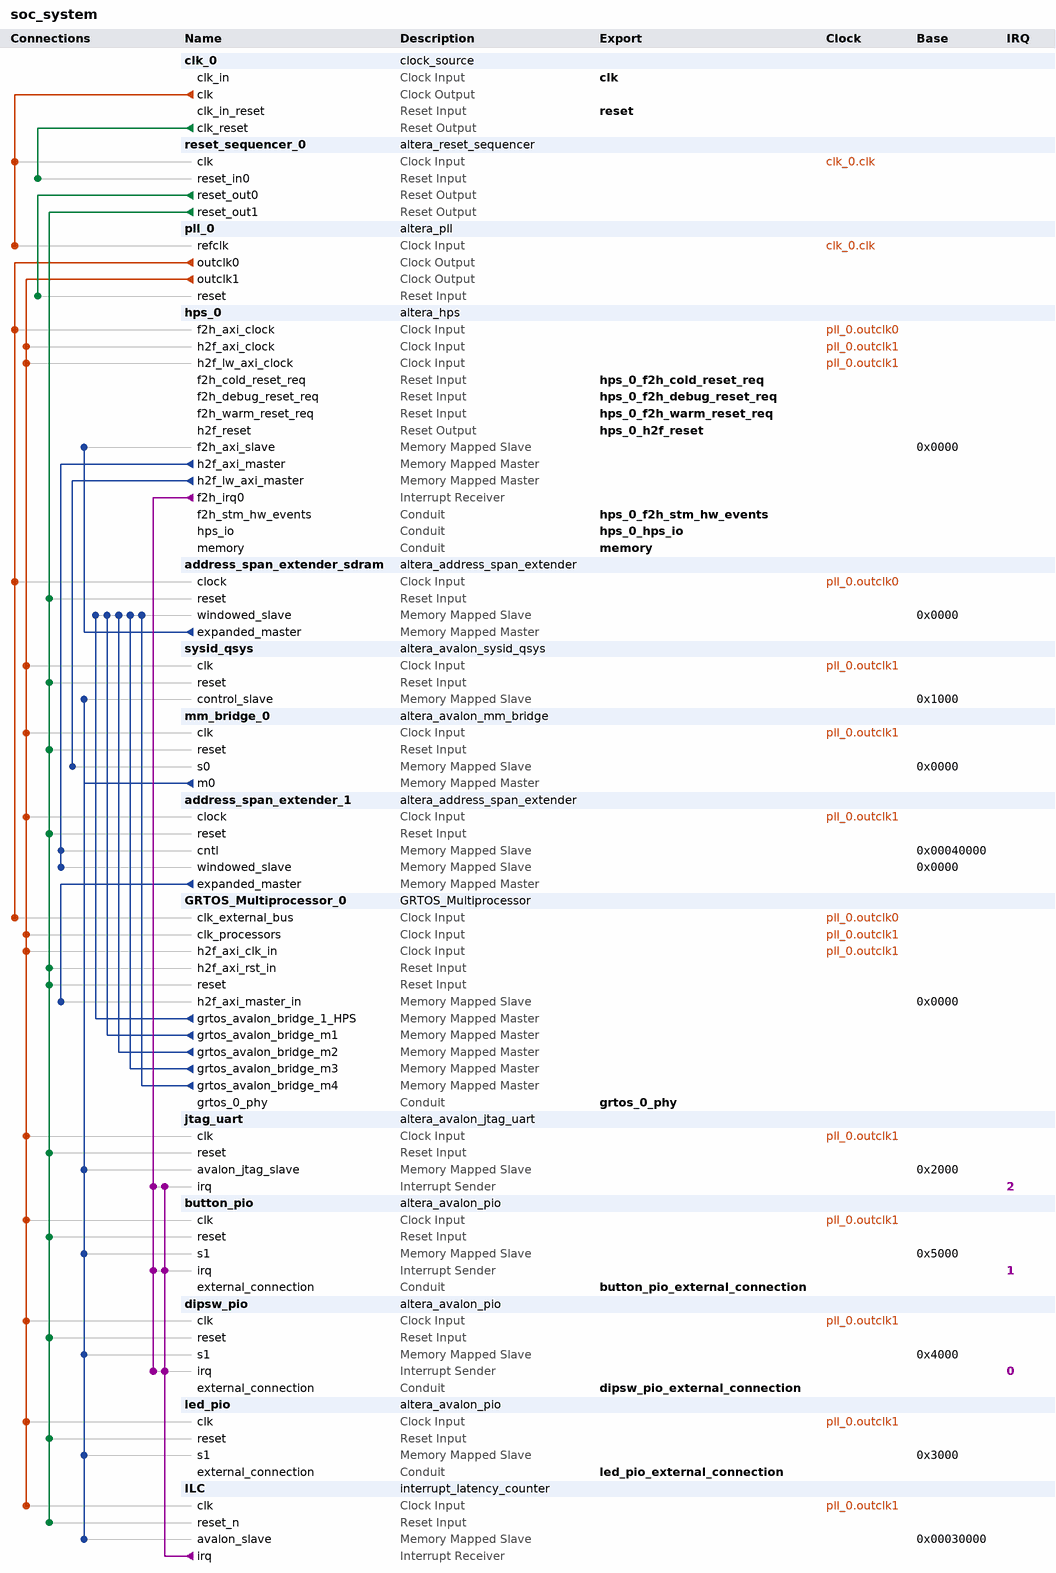
[diagram p0: system contents]
# Platform Designer (Qsys) system soc_system, Cyclone V 5CSEBA6U23I7
# Parameters at their usual value, and those the tool derives, are not listed.
package require -exact qsys 18.0
create_system soc_system
set_project_property DEVICE_FAMILY {Cyclone V}
set_project_property DEVICE 5CSEBA6U23I7

add_instance clk_0 clock_source 18.0
set_instance_parameter_value clk_0 clockFrequency 50000000
set_instance_parameter_value clk_0 resetSynchronousEdges DEASSERT

add_instance reset_sequencer_0 altera_reset_sequencer 18.0
set_instance_parameter_value reset_sequencer_0 ENABLE_CSR 0
set_instance_parameter_value reset_sequencer_0 ENABLE_RESET_REQUEST_INPUT 0
set_instance_parameter_value reset_sequencer_0 LIST_ASRT_DELAY 0,200,0,0,0,0,0,0,0,0
set_instance_parameter_value reset_sequencer_0 LIST_ASRT_SEQ 0,1,2,3,4,5,6,7,8,9
set_instance_parameter_value reset_sequencer_0 LIST_DSRT_DELAY 300,300,0,0,0,0,0,0,0,0
set_instance_parameter_value reset_sequencer_0 LIST_DSRT_SEQ 0,1,2,3,4,5,6,7,8,9
set_instance_parameter_value reset_sequencer_0 MIN_ASRT_TIME 100
set_instance_parameter_value reset_sequencer_0 NUM_INPUTS 1
set_instance_parameter_value reset_sequencer_0 NUM_OUTPUTS 2
set_instance_parameter_value reset_sequencer_0 USE_DSRT_QUAL 0,0,0,0,0,0,0,0,0,0

add_instance pll_0 altera_pll 18.0
set_instance_parameter_value pll_0 gui_device_speed_grade 1
set_instance_parameter_value pll_0 gui_number_of_clocks 2
set_instance_parameter_value pll_0 gui_operation_mode direct
set_instance_parameter_value pll_0 gui_output_clock_frequency0 120.0
set_instance_parameter_value pll_0 gui_output_clock_frequency1 20.0
set_instance_parameter_value pll_0 gui_pll_mode {Integer-N PLL}
set_instance_parameter_value pll_0 gui_reference_clock_frequency 50.0
set_instance_parameter_value pll_0 gui_switchover_mode {Manual Switchover}
set_instance_parameter_value pll_0 gui_use_locked false

add_instance hps_0 altera_hps 18.0
set_instance_parameter_value hps_0 EMAC1_Mode RGMII
set_instance_parameter_value hps_0 EMAC1_PinMuxing {HPS I/O Set 0}
set_instance_parameter_value hps_0 F2SCLK_COLDRST_Enable true
set_instance_parameter_value hps_0 F2SCLK_DBGRST_Enable true
set_instance_parameter_value hps_0 F2SCLK_WARMRST_Enable true
set_instance_parameter_value hps_0 F2SINTERRUPT_Enable true
set_instance_parameter_value hps_0 F2S_Width 1
set_instance_parameter_value hps_0 FPGA_PERIPHERAL_OUTPUT_CLOCK_FREQ_EMAC0_GTX_CLK 100
set_instance_parameter_value hps_0 FPGA_PERIPHERAL_OUTPUT_CLOCK_FREQ_EMAC0_MD_CLK 100.0
set_instance_parameter_value hps_0 FPGA_PERIPHERAL_OUTPUT_CLOCK_FREQ_EMAC1_GTX_CLK 100
set_instance_parameter_value hps_0 FPGA_PERIPHERAL_OUTPUT_CLOCK_FREQ_EMAC1_MD_CLK 100.0
set_instance_parameter_value hps_0 HPS_PROTOCOL DDR3
set_instance_parameter_value hps_0 I2C0_Mode I2C
set_instance_parameter_value hps_0 I2C0_PinMuxing {HPS I/O Set 0}
set_instance_parameter_value hps_0 I2C1_Mode I2C
set_instance_parameter_value hps_0 I2C1_PinMuxing {HPS I/O Set 0}
set_instance_parameter_value hps_0 LWH2F_Enable true
set_instance_parameter_value hps_0 MEM_BANKADDR_WIDTH 3
set_instance_parameter_value hps_0 MEM_CLK_FREQ 400.0
set_instance_parameter_value hps_0 MEM_COL_ADDR_WIDTH 10
set_instance_parameter_value hps_0 MEM_DQ_WIDTH 32
set_instance_parameter_value hps_0 MEM_DRV_STR RZQ/6
set_instance_parameter_value hps_0 MEM_ROW_ADDR_WIDTH 15
set_instance_parameter_value hps_0 MEM_RTT_NOM RZQ/6
set_instance_parameter_value hps_0 MEM_RTT_WR {Dynamic ODT off}
set_instance_parameter_value hps_0 MEM_TCL 7
set_instance_parameter_value hps_0 MEM_TFAW_NS 37.5
set_instance_parameter_value hps_0 MEM_TRAS_NS 35.0
set_instance_parameter_value hps_0 MEM_TRCD_NS 13.75
set_instance_parameter_value hps_0 MEM_TRFC_NS 300.0
set_instance_parameter_value hps_0 MEM_TRP_NS 13.75
set_instance_parameter_value hps_0 MEM_VENDOR Other
set_instance_parameter_value hps_0 MEM_WTCL 7
set_instance_parameter_value hps_0 QSPI_Mode N/A
set_instance_parameter_value hps_0 QSPI_PinMuxing Unused
set_instance_parameter_value hps_0 REF_CLK_FREQ 25.0
set_instance_parameter_value hps_0 S2FCLK_USER2CLK 4
set_instance_parameter_value hps_0 S2F_Width 1
set_instance_parameter_value hps_0 SDIO_Mode {4-bit Data}
set_instance_parameter_value hps_0 SDIO_PinMuxing {HPS I/O Set 0}
set_instance_parameter_value hps_0 SPIM1_Mode {Single Slave Select}
set_instance_parameter_value hps_0 SPIM1_PinMuxing {HPS I/O Set 0}
set_instance_parameter_value hps_0 STM_Enable true
set_instance_parameter_value hps_0 TIMING_BOARD_AC_SKEW 0.02
set_instance_parameter_value hps_0 TIMING_BOARD_AC_TO_CK_SKEW 0.0
set_instance_parameter_value hps_0 TIMING_BOARD_DQ_TO_DQS_SKEW 0.0
set_instance_parameter_value hps_0 TIMING_BOARD_MAX_CK_DELAY 0.6
set_instance_parameter_value hps_0 TIMING_BOARD_MAX_DQS_DELAY 0.6
set_instance_parameter_value hps_0 TIMING_BOARD_SKEW_BETWEEN_DQS 0.02
set_instance_parameter_value hps_0 TIMING_BOARD_SKEW_CKDQS_DIMM_MAX 0.01
set_instance_parameter_value hps_0 TIMING_BOARD_SKEW_CKDQS_DIMM_MIN -0.01
set_instance_parameter_value hps_0 TIMING_BOARD_SKEW_WITHIN_DQS 0.02
set_instance_parameter_value hps_0 TIMING_TDH 125
set_instance_parameter_value hps_0 TIMING_TDQSCK 400
set_instance_parameter_value hps_0 TIMING_TDQSQ 120
set_instance_parameter_value hps_0 TIMING_TDS 50
set_instance_parameter_value hps_0 TIMING_TIH 250
set_instance_parameter_value hps_0 TIMING_TIS 175
set_instance_parameter_value hps_0 TIMING_TQSH 0.38
set_instance_parameter_value hps_0 UART0_Mode {No Flow Control}
set_instance_parameter_value hps_0 UART0_PinMuxing {HPS I/O Set 0}
set_instance_parameter_value hps_0 USB1_Mode SDR
set_instance_parameter_value hps_0 USB1_PinMuxing {HPS I/O Set 0}
set_instance_parameter_value hps_0 desired_cfg_clk_mhz 100.0
set_instance_parameter_value hps_0 desired_qspi_clk_mhz 370.0

add_instance address_span_extender_sdram altera_address_span_extender 18.0
set_instance_parameter_value address_span_extender_sdram BURSTCOUNT_WIDTH 1
set_instance_parameter_value address_span_extender_sdram DATA_WIDTH 32
set_instance_parameter_value address_span_extender_sdram ENABLE_SLAVE_PORT false
set_instance_parameter_value address_span_extender_sdram MASTER_ADDRESS_DEF 536870912
set_instance_parameter_value address_span_extender_sdram MAX_PENDING_READS 32
set_instance_parameter_value address_span_extender_sdram SLAVE_ADDRESS_WIDTH 24

add_instance sysid_qsys altera_avalon_sysid_qsys 18.0
set_instance_parameter_value sysid_qsys id -1395322110

add_instance mm_bridge_0 altera_avalon_mm_bridge 18.0
set_instance_parameter_value mm_bridge_0 ADDRESS_UNITS SYMBOLS
set_instance_parameter_value mm_bridge_0 ADDRESS_WIDTH 10
set_instance_parameter_value mm_bridge_0 DATA_WIDTH 32
set_instance_parameter_value mm_bridge_0 MAX_PENDING_RESPONSES 4
set_instance_parameter_value mm_bridge_0 USE_AUTO_ADDRESS_WIDTH 1

add_instance address_span_extender_1 altera_address_span_extender 18.0
set_instance_parameter_value address_span_extender_1 BURSTCOUNT_WIDTH 1
set_instance_parameter_value address_span_extender_1 DATA_WIDTH 32
set_instance_parameter_value address_span_extender_1 ENABLE_SLAVE_PORT true
set_instance_parameter_value address_span_extender_1 MASTER_ADDRESS_DEF 0
set_instance_parameter_value address_span_extender_1 MAX_PENDING_READS 64
set_instance_parameter_value address_span_extender_1 SLAVE_ADDRESS_WIDTH 16

add_instance GRTOS_Multiprocessor_0 GRTOS_Multiprocessor 1.0
set_instance_parameter_value GRTOS_Multiprocessor_0 BUS_WIDTH 26
set_instance_parameter_value GRTOS_Multiprocessor_0 CEFrequency 120000000
set_instance_parameter_value GRTOS_Multiprocessor_0 CFrequency 20000000
set_instance_parameter_value GRTOS_Multiprocessor_0 ENABLE_HPS_MAP_ACCESS true
set_instance_parameter_value GRTOS_Multiprocessor_0 NProcessors 4
set_instance_parameter_value GRTOS_Multiprocessor_0 Processor_type {Nios II/e (economy)}

add_instance jtag_uart altera_avalon_jtag_uart 18.0
set_instance_parameter_value jtag_uart allowMultipleConnections true
set_instance_parameter_value jtag_uart simInteractiveOptions INTERACTIVE_ASCII_OUTPUT

add_instance button_pio altera_avalon_pio 18.0
set_instance_parameter_value button_pio bitClearingEdgeCapReg true
set_instance_parameter_value button_pio captureEdge true
set_instance_parameter_value button_pio direction Input
set_instance_parameter_value button_pio edgeType FALLING
set_instance_parameter_value button_pio generateIRQ true
set_instance_parameter_value button_pio irqType EDGE
set_instance_parameter_value button_pio width 2

add_instance dipsw_pio altera_avalon_pio 18.0
set_instance_parameter_value dipsw_pio bitClearingEdgeCapReg true
set_instance_parameter_value dipsw_pio captureEdge true
set_instance_parameter_value dipsw_pio direction Input
set_instance_parameter_value dipsw_pio edgeType ANY
set_instance_parameter_value dipsw_pio generateIRQ true
set_instance_parameter_value dipsw_pio irqType EDGE
set_instance_parameter_value dipsw_pio width 4

add_instance led_pio altera_avalon_pio 18.0
set_instance_parameter_value led_pio direction Output
set_instance_parameter_value led_pio resetValue 127
set_instance_parameter_value led_pio width 7

add_instance ILC interrupt_latency_counter 18.0
set_instance_parameter_value ILC CLOCK_RATE 20000000

# connections
add_connection clk_0.clk pll_0.refclk clock
add_connection clk_0.clk reset_sequencer_0.clk clock
add_connection pll_0.outclk0 address_span_extender_sdram.clock clock
add_connection pll_0.outclk0 GRTOS_Multiprocessor_0.clk_external_bus clock
add_connection pll_0.outclk0 hps_0.f2h_axi_clock clock
add_connection pll_0.outclk1 address_span_extender_1.clock clock
add_connection pll_0.outclk1 button_pio.clk clock
add_connection pll_0.outclk1 dipsw_pio.clk clock
add_connection pll_0.outclk1 GRTOS_Multiprocessor_0.clk_processors clock
add_connection pll_0.outclk1 GRTOS_Multiprocessor_0.h2f_axi_clk_in clock
add_connection pll_0.outclk1 hps_0.h2f_axi_clock clock
add_connection pll_0.outclk1 hps_0.h2f_lw_axi_clock clock
add_connection pll_0.outclk1 ILC.clk clock
add_connection pll_0.outclk1 jtag_uart.clk clock
add_connection pll_0.outclk1 led_pio.clk clock
add_connection pll_0.outclk1 mm_bridge_0.clk clock
add_connection pll_0.outclk1 sysid_qsys.clk clock
add_connection clk_0.clk_reset reset_sequencer_0.reset_in0 reset
add_connection reset_sequencer_0.reset_out0 pll_0.reset reset
add_connection reset_sequencer_0.reset_out1 address_span_extender_1.reset reset
add_connection reset_sequencer_0.reset_out1 address_span_extender_sdram.reset reset
add_connection reset_sequencer_0.reset_out1 button_pio.reset reset
add_connection reset_sequencer_0.reset_out1 dipsw_pio.reset reset
add_connection reset_sequencer_0.reset_out1 GRTOS_Multiprocessor_0.h2f_axi_rst_in reset
add_connection reset_sequencer_0.reset_out1 GRTOS_Multiprocessor_0.reset reset
add_connection reset_sequencer_0.reset_out1 ILC.reset_n reset
add_connection reset_sequencer_0.reset_out1 jtag_uart.reset reset
add_connection reset_sequencer_0.reset_out1 led_pio.reset reset
add_connection reset_sequencer_0.reset_out1 mm_bridge_0.reset reset
add_connection reset_sequencer_0.reset_out1 sysid_qsys.reset reset
add_connection address_span_extender_1.expanded_master GRTOS_Multiprocessor_0.h2f_axi_master_in avalon
set_connection_parameter_value address_span_extender_1.expanded_master/GRTOS_Multiprocessor_0.h2f_axi_master_in baseAddress 0x0000
add_connection address_span_extender_sdram.expanded_master hps_0.f2h_axi_slave avalon
set_connection_parameter_value address_span_extender_sdram.expanded_master/hps_0.f2h_axi_slave baseAddress 0x0000
add_connection GRTOS_Multiprocessor_0.grtos_avalon_bridge_1_HPS address_span_extender_sdram.windowed_slave avalon
set_connection_parameter_value GRTOS_Multiprocessor_0.grtos_avalon_bridge_1_HPS/address_span_extender_sdram.windowed_slave baseAddress 0x0000
add_connection GRTOS_Multiprocessor_0.grtos_avalon_bridge_m1 address_span_extender_sdram.windowed_slave avalon
set_connection_parameter_value GRTOS_Multiprocessor_0.grtos_avalon_bridge_m1/address_span_extender_sdram.windowed_slave baseAddress 0x0000
add_connection GRTOS_Multiprocessor_0.grtos_avalon_bridge_m2 address_span_extender_sdram.windowed_slave avalon
set_connection_parameter_value GRTOS_Multiprocessor_0.grtos_avalon_bridge_m2/address_span_extender_sdram.windowed_slave baseAddress 0x0000
add_connection GRTOS_Multiprocessor_0.grtos_avalon_bridge_m3 address_span_extender_sdram.windowed_slave avalon
set_connection_parameter_value GRTOS_Multiprocessor_0.grtos_avalon_bridge_m3/address_span_extender_sdram.windowed_slave baseAddress 0x0000
add_connection GRTOS_Multiprocessor_0.grtos_avalon_bridge_m4 address_span_extender_sdram.windowed_slave avalon
set_connection_parameter_value GRTOS_Multiprocessor_0.grtos_avalon_bridge_m4/address_span_extender_sdram.windowed_slave baseAddress 0x0000
add_connection hps_0.h2f_axi_master address_span_extender_1.cntl avalon
set_connection_parameter_value hps_0.h2f_axi_master/address_span_extender_1.cntl baseAddress 0x00040000
add_connection hps_0.h2f_axi_master address_span_extender_1.windowed_slave avalon
set_connection_parameter_value hps_0.h2f_axi_master/address_span_extender_1.windowed_slave baseAddress 0x0000
add_connection hps_0.h2f_lw_axi_master mm_bridge_0.s0 avalon
set_connection_parameter_value hps_0.h2f_lw_axi_master/mm_bridge_0.s0 baseAddress 0x0000
add_connection mm_bridge_0.m0 button_pio.s1 avalon
set_connection_parameter_value mm_bridge_0.m0/button_pio.s1 baseAddress 0x5000
add_connection mm_bridge_0.m0 dipsw_pio.s1 avalon
set_connection_parameter_value mm_bridge_0.m0/dipsw_pio.s1 baseAddress 0x4000
add_connection mm_bridge_0.m0 ILC.avalon_slave avalon
set_connection_parameter_value mm_bridge_0.m0/ILC.avalon_slave baseAddress 0x00030000
add_connection mm_bridge_0.m0 jtag_uart.avalon_jtag_slave avalon
set_connection_parameter_value mm_bridge_0.m0/jtag_uart.avalon_jtag_slave baseAddress 0x2000
add_connection mm_bridge_0.m0 led_pio.s1 avalon
set_connection_parameter_value mm_bridge_0.m0/led_pio.s1 baseAddress 0x3000
add_connection mm_bridge_0.m0 sysid_qsys.control_slave avalon
set_connection_parameter_value mm_bridge_0.m0/sysid_qsys.control_slave baseAddress 0x1000
add_connection hps_0.f2h_irq0 button_pio.irq interrupt
set_connection_parameter_value hps_0.f2h_irq0/button_pio.irq irqNumber 1
add_connection hps_0.f2h_irq0 dipsw_pio.irq interrupt
set_connection_parameter_value hps_0.f2h_irq0/dipsw_pio.irq irqNumber 0
add_connection hps_0.f2h_irq0 jtag_uart.irq interrupt
set_connection_parameter_value hps_0.f2h_irq0/jtag_uart.irq irqNumber 2
add_connection ILC.irq button_pio.irq interrupt
set_connection_parameter_value ILC.irq/button_pio.irq irqNumber 1
add_connection ILC.irq dipsw_pio.irq interrupt
set_connection_parameter_value ILC.irq/dipsw_pio.irq irqNumber 0
add_connection ILC.irq jtag_uart.irq interrupt
set_connection_parameter_value ILC.irq/jtag_uart.irq irqNumber 2

# exported interfaces
add_interface button_pio_external_connection conduit end
set_interface_property button_pio_external_connection EXPORT_OF button_pio.external_connection
add_interface clk clock sink
set_interface_property clk EXPORT_OF clk_0.clk_in
add_interface dipsw_pio_external_connection conduit end
set_interface_property dipsw_pio_external_connection EXPORT_OF dipsw_pio.external_connection
add_interface grtos_0_phy conduit end
set_interface_property grtos_0_phy EXPORT_OF GRTOS_Multiprocessor_0.grtos_0_phy
add_interface hps_0_f2h_cold_reset_req reset sink
set_interface_property hps_0_f2h_cold_reset_req EXPORT_OF hps_0.f2h_cold_reset_req
add_interface hps_0_f2h_debug_reset_req reset sink
set_interface_property hps_0_f2h_debug_reset_req EXPORT_OF hps_0.f2h_debug_reset_req
add_interface hps_0_f2h_stm_hw_events conduit end
set_interface_property hps_0_f2h_stm_hw_events EXPORT_OF hps_0.f2h_stm_hw_events
add_interface hps_0_f2h_warm_reset_req reset sink
set_interface_property hps_0_f2h_warm_reset_req EXPORT_OF hps_0.f2h_warm_reset_req
add_interface hps_0_h2f_reset reset source
set_interface_property hps_0_h2f_reset EXPORT_OF hps_0.h2f_reset
add_interface hps_0_hps_io conduit end
set_interface_property hps_0_hps_io EXPORT_OF hps_0.hps_io
add_interface led_pio_external_connection conduit end
set_interface_property led_pio_external_connection EXPORT_OF led_pio.external_connection
add_interface memory conduit end
set_interface_property memory EXPORT_OF hps_0.memory
add_interface reset reset sink
set_interface_property reset EXPORT_OF clk_0.clk_in_reset

set_interconnect_requirement {$system} qsys_mm.clockCrossingAdapter AUTO
set_interconnect_requirement {$system} qsys_mm.maxAdditionalLatency 2

save_system soc_system.qsys
